# Altium schematic sheet Schematic.SchDoc
size A4
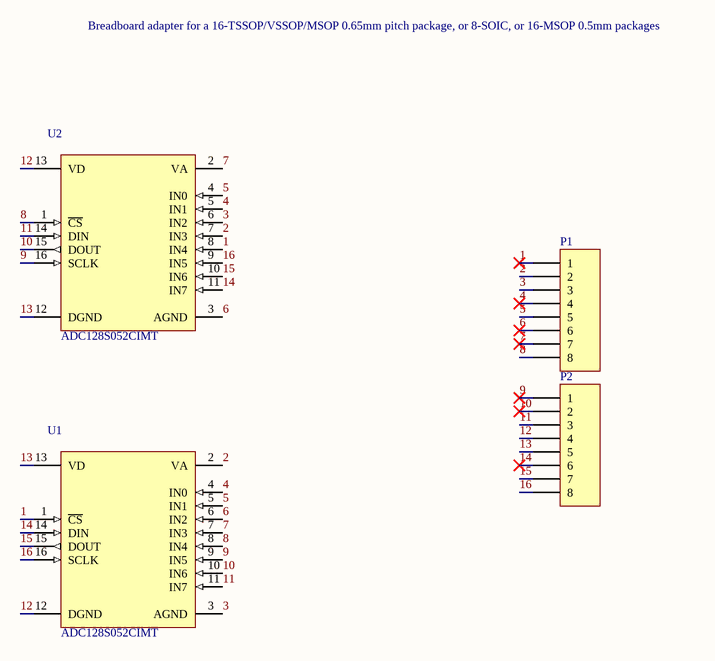
[diagram p0: Schematic.SchDoc]

## Parts
P1  (no value)  [HDR1X8]
P2  (no value)  [HDR1X8]
U1  ADC128S052CIMT  [TSSOP/VSSOP/MSOP-0.65mm-16,SOIC-8]
U2  ADC128S052CIMT  [MSOP-0.5mmPitch-16N-3mmBody-1.1mm]

## Nets
1: P1.1 U1.1(~{CS}) U2.8(IN4)
2: P1.2 U1.2(VA) U2.7(IN3)
3: P1.3 U1.3(AGND) U2.6(IN2)
4: P1.4 U1.4(IN0) U2.5(IN1)
5: P1.5 U1.5(IN1) U2.4(IN0)
6: P1.6 U1.6(IN2) U2.3(AGND)
7: P1.7 U1.7(IN3) U2.2(VA)
8: P1.8 U1.8(IN4) U2.1(~{CS})
9: P2.1 U1.9(IN5) U2.16(SCLK)
10: P2.2 U1.10(IN6) U2.15(DOUT)
11: P2.3 U1.11(IN7) U2.14(DIN)
12: P2.4 U1.12(DGND) U2.13(VD)
13: P2.5 U1.13(VD) U2.12(DGND)
14: P2.6 U1.14(DIN) U2.11(IN7)
15: P2.7 U1.15(DOUT) U2.10(IN6)
16: P2.8 U1.16(SCLK) U2.9(IN5)

## Notes on the sheet
- Breadboard adapter for a 16-TSSOP/VSSOP/MSOP 0.65mm pitch package, or 8-SOIC, or 16-MSOP 0.5mm packages

## Library data of the parts
P1 P2 = Header 8: Header, 8-Pin; LatestRevisionDate: 17-Jul-2002; LatestRevisionNote: Re-released for DXP Platform.; Publisher: Altium Limited
U1 U2 = ADC128S052CIMT: 8-Channel 12-Bit ADC; MF: Texas Instruments; MP: ADC128S052CIMT/NOPB; Package: TSSOP-16 Texas Instruments; Availability: Unavailable; SnapEDA_Link: https://www.snapeda.com/parts/ADC128S052CIMT/NOPB/Texas%20Instruments/view-part/?ref=snap; Price: None; Value: *